# EAGLE schematic GankenKunCircuit (EAGLE 9.4.0)
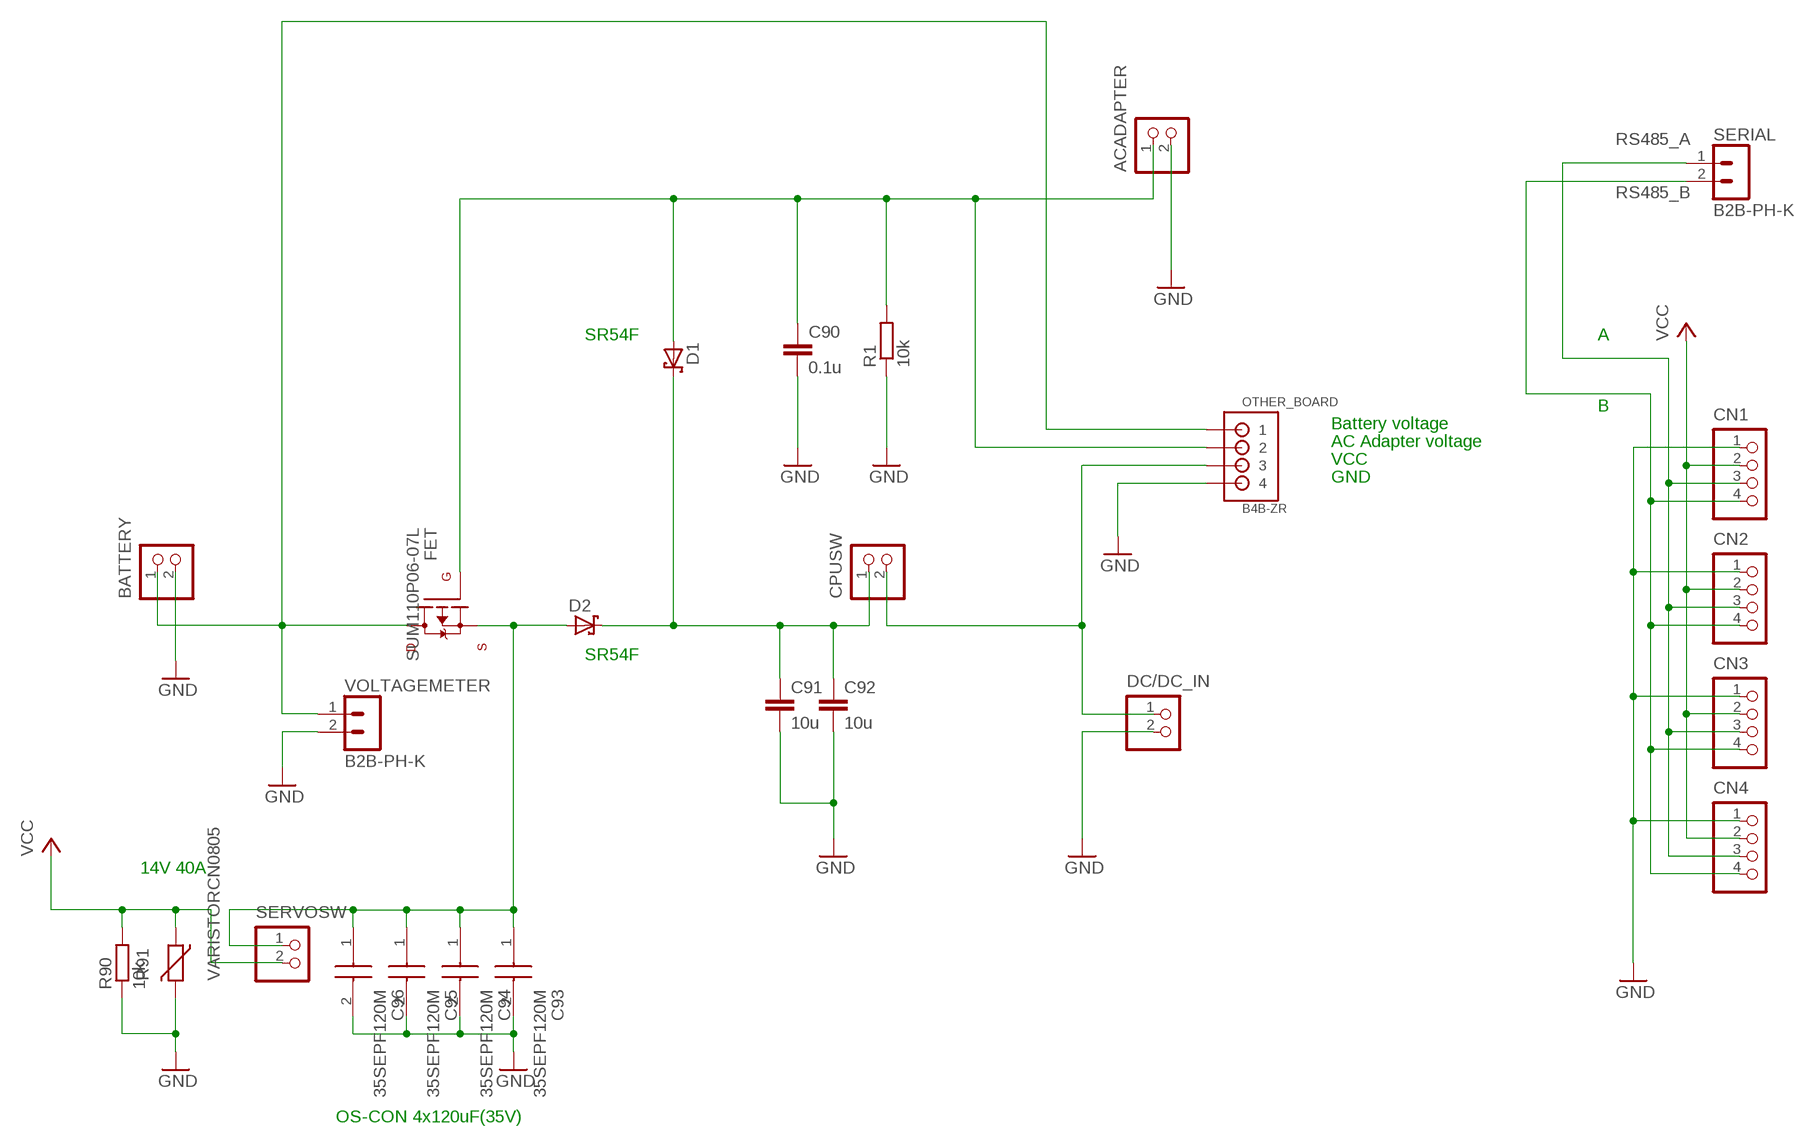
[diagram p0: schematic, sheet 1]

## Parts
ACADAPTER  B2B-XH-A  [B2B-XH-A]
BATTERY  B2P-VH  [B2P-VH]
C90  0.1u  C-EUC1608  [C1608]
C91  10u  C-EUC3216  [C3216]
C92  10u  C-EUC3216  [C3216]
C93  35SEPF120M  [CAPPRD500W65D1000H1350]
C94  35SEPF120M  [CAPPRD500W65D1000H1350]
C95  35SEPF120M  [CAPPRD500W65D1000H1350]
C96  35SEPF120M  [CAPPRD500W65D1000H1350]
CN1  B4B-XH-A  [B4B-XH-A]
CN2  B4B-XH-A  [B4B-XH-A]
CN3  B4B-XH-A  [B4B-XH-A]
CN4  B4B-XH-A  [B4B-XH-A]
CPUSW  B2B-XH-A  [B2B-XH-A]
D1  SCHOTTKY-DIODESMD  [SMB]
D2  SCHOTTKY-DIODESMD  [SMB]
DC/DC_IN  B2B-XH-A  [B2B-XH-A]
FET  SUM110P06-07L  [TO-263-2]
OTHER_BOARD  B4B-ZR  [B4B-ZR]
R1  10k  R-EU_R0603  [R0603]
R90  10k  R-EU_R0603  [R0603]
R91  VARISTORCN0805  [CT/CN0805]
SERIAL  B2B-PH-K  [B2B-PH-K]
SERVOSW  B2P-VH  [B2P-VH]
VOLTAGEMETER  B2B-PH-K  [B2B-PH-K]

## Nets
GND: ACADAPTER.2 BATTERY.2 C90.2 C91.2 C92.2 C93.2(-) C94.2(-) C95.2(-) C96.2(-) CN1.1 CN2.1 CN3.1 CN4.1 DC/DC_IN.2 OTHER_BOARD.4 R1.1 R90.1 R91.2 VOLTAGEMETER.2
N$12: BATTERY.1 FET.4(D) OTHER_BOARD.1 VOLTAGEMETER.1
N$13: C93.1(+) C94.1(+) C95.1(+) C96.1(+) D2.A FET.3(S) SERVOSW.1
N$15: C91.1 C92.1 CPUSW.1 D1.C D2.C
N$16: ACADAPTER.1 C90.1 D1.A FET.1(G) OTHER_BOARD.2 R1.2
N$18: CPUSW.2 DC/DC_IN.1 OTHER_BOARD.3
RS485_A: CN1.3 CN2.3 CN3.3 CN4.3 SERIAL.1
RS485_B: CN1.4 CN2.4 CN3.4 CN4.4 SERIAL.2
VCC: CN1.2 CN2.2 CN3.2 CN4.2 R90.2 R91.1 SERVOSW.2

## Notes on the sheet
- SR54F | A
- B
- Battery voltage
- AC Adapter voltage
- VCC
- GND
- SR54F
- 14V 40A
- OS-CON 4x120uF(35V)

## Library data of the parts
ACADAPTER CPUSW DC/DC_IN = jst-xh:B2B-XH-A: Wire-to-Board 2.5mm pitch top mount connector Source: http://www.jst-mfg.com/product/pdf/jpn/XH.pdf http://www.jst-mfg.com/product/detail.php?series=277
BATTERY SERVOSW = jst-vh:B2P-VH: Wire-to-Board 3.96mm pitch top mount connector Source: http://www.jst-mfg.com/product/pdf/jpn/VH.pdf http://www.jst-mfg.com/product/detail.php?series=262
C90-C92 = rcl:C-EU: CAPACITOR, European symbol
C93-C96 = 35SEPF120M:35SEPF120M: Panasonic 120uF 35 V dc Polymer Aluminium Capacitor F13, OS-CON Series 5000h 10 x 13mm Source: Datasheet <https://industrial.panasonic.com/cdbs/www-data/pdf/AAB8000/AAB8000C252.pdf>; DESCRIPTION: Panasonic 120uF 35 V dc Polymer Aluminium Capacitor F13, OS-CON Series 5000h 10 x 13mm; HEIGHT: 13.5mm; MANUFACTURER_NAME: Panasonic; MANUFACTURER_PART_NUMBER: 35SEPF120M; MOUSER_PART_NUMBER: 667-35SEPF120M; MOUSER_PRICE-STOCK: https://www.mouser.com/Search/Refine.aspx?Keyword=667-35SEPF120M; RS_PART_NUMBER: 1000082; RS_PRICE-STOCK: http://uk.rs-online.com/web/p/products/1000082
CN1-CN4 = jst-xh:B4B-XH-A: Wire-to-Board 2.5mm pitch top mount connector Source: http://www.jst-mfg.com/product/pdf/jpn/XH.pdf http://www.jst-mfg.com/product/detail.php?series=277
D1 D2 = diode:SCHOTTKY-DIODE: Schottky Diode
FET = SUM110P06-07L:SUM110P06-07L; AVAILABILITY: Unavailable; MF: Vishay; MP: SUM110P06-07L; PACKAGE: None; PRICE: None
OTHER_BOARD = jst:B4B-ZR: JST-ZH Connector 4 pol, 1.5mm pitch Package: B4B-ZR Source: http://www.jst-mfg.com/product/pdf/eng/eZH.pdf
R1 R90 = rcl:R-EU_: RESISTOR, European symbol
R91 = varistor:VARISTOR: VARISTOR
SERIAL VOLTAGEMETER = jst-ph:B2B-PH-K: HEADER